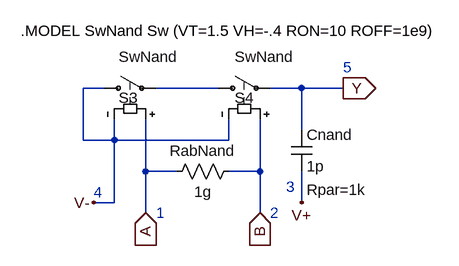
[diagram p0: schematic Nand.asc]
Nand.asc, the LTspice schematic file:
Version 4
SHEET 1 896 680
WIRE -80 304 -80 224
WIRE -48 224 -80 224
WIRE -32 304 -80 304
WIRE -32 304 -32 272
WIRE -32 400 -64 400
WIRE -32 400 -32 304
WIRE 16 352 16 272
WIRE 16 416 16 352
WIRE 64 352 16 352
WIRE 128 224 32 224
WIRE 144 304 -32 304
WIRE 144 304 144 272
WIRE 192 352 144 352
WIRE 192 352 192 272
WIRE 192 416 192 352
WIRE 256 224 208 224
WIRE 256 288 256 224
WIRE 256 400 256 352
WIRE 320 224 256 224
FLAG 320 224 Y
IOPIN 320 224 Out
FLAG 16 416 A
IOPIN 16 416 In
FLAG 192 416 B
IOPIN 192 416 In
FLAG -64 400 V-
FLAG 256 400 V+
SYMBOL sw -64 224 R270
WINDOW 0 -15 39 VRight 0
WINDOW 3 48 39 VRight 0
SYMATTR InstName S3
SYMATTR Value SwNand
SYMBOL sw 112 224 R270
WINDOW 0 -15 41 VRight 0
WINDOW 3 48 41 VRight 0
SYMATTR InstName S4
SYMATTR Value SwNand
SYMBOL res 160 336 R90
WINDOW 0 0 56 VBottom 0
WINDOW 3 32 56 VTop 0
SYMATTR InstName RabNand
SYMATTR Value 1g
SYMBOL cap 240 288 R0
WINDOW 39 24 92 Left 0
SYMATTR SpiceLine Rpar=1k
SYMATTR InstName Cnand
SYMATTR Value 1p
TEXT -176 136 Left 0 !.MODEL SwNand Sw (VT=1.5 VH=-.4 RON=10 ROFF=1e9)
TEXT 32 416 Left 0 ;1
TEXT 208 416 Left 0 ;2
TEXT 320 192 Left 0 ;5
TEXT 232 376 Left 0 ;3
TEXT -64 384 Left 0 ;4

The netlist it stands for:
* Nand.asc
S3 V- N001 A V- SwNand
S4 N001 Y B V- SwNand
RabNand B A 1g
Cnand Y V+ 1p Rpar=1k
.MODEL SwNand Sw (VT=1.5 VH=-.4 RON=10 ROFF=1e9)
* 1
* 2
* 5
* 3
* 4
.backanno
.end